# EAGLE schematic esp32_rtc_display_rev2_v9 (EAGLE 9.7.0)

## Sheet 1 of 4
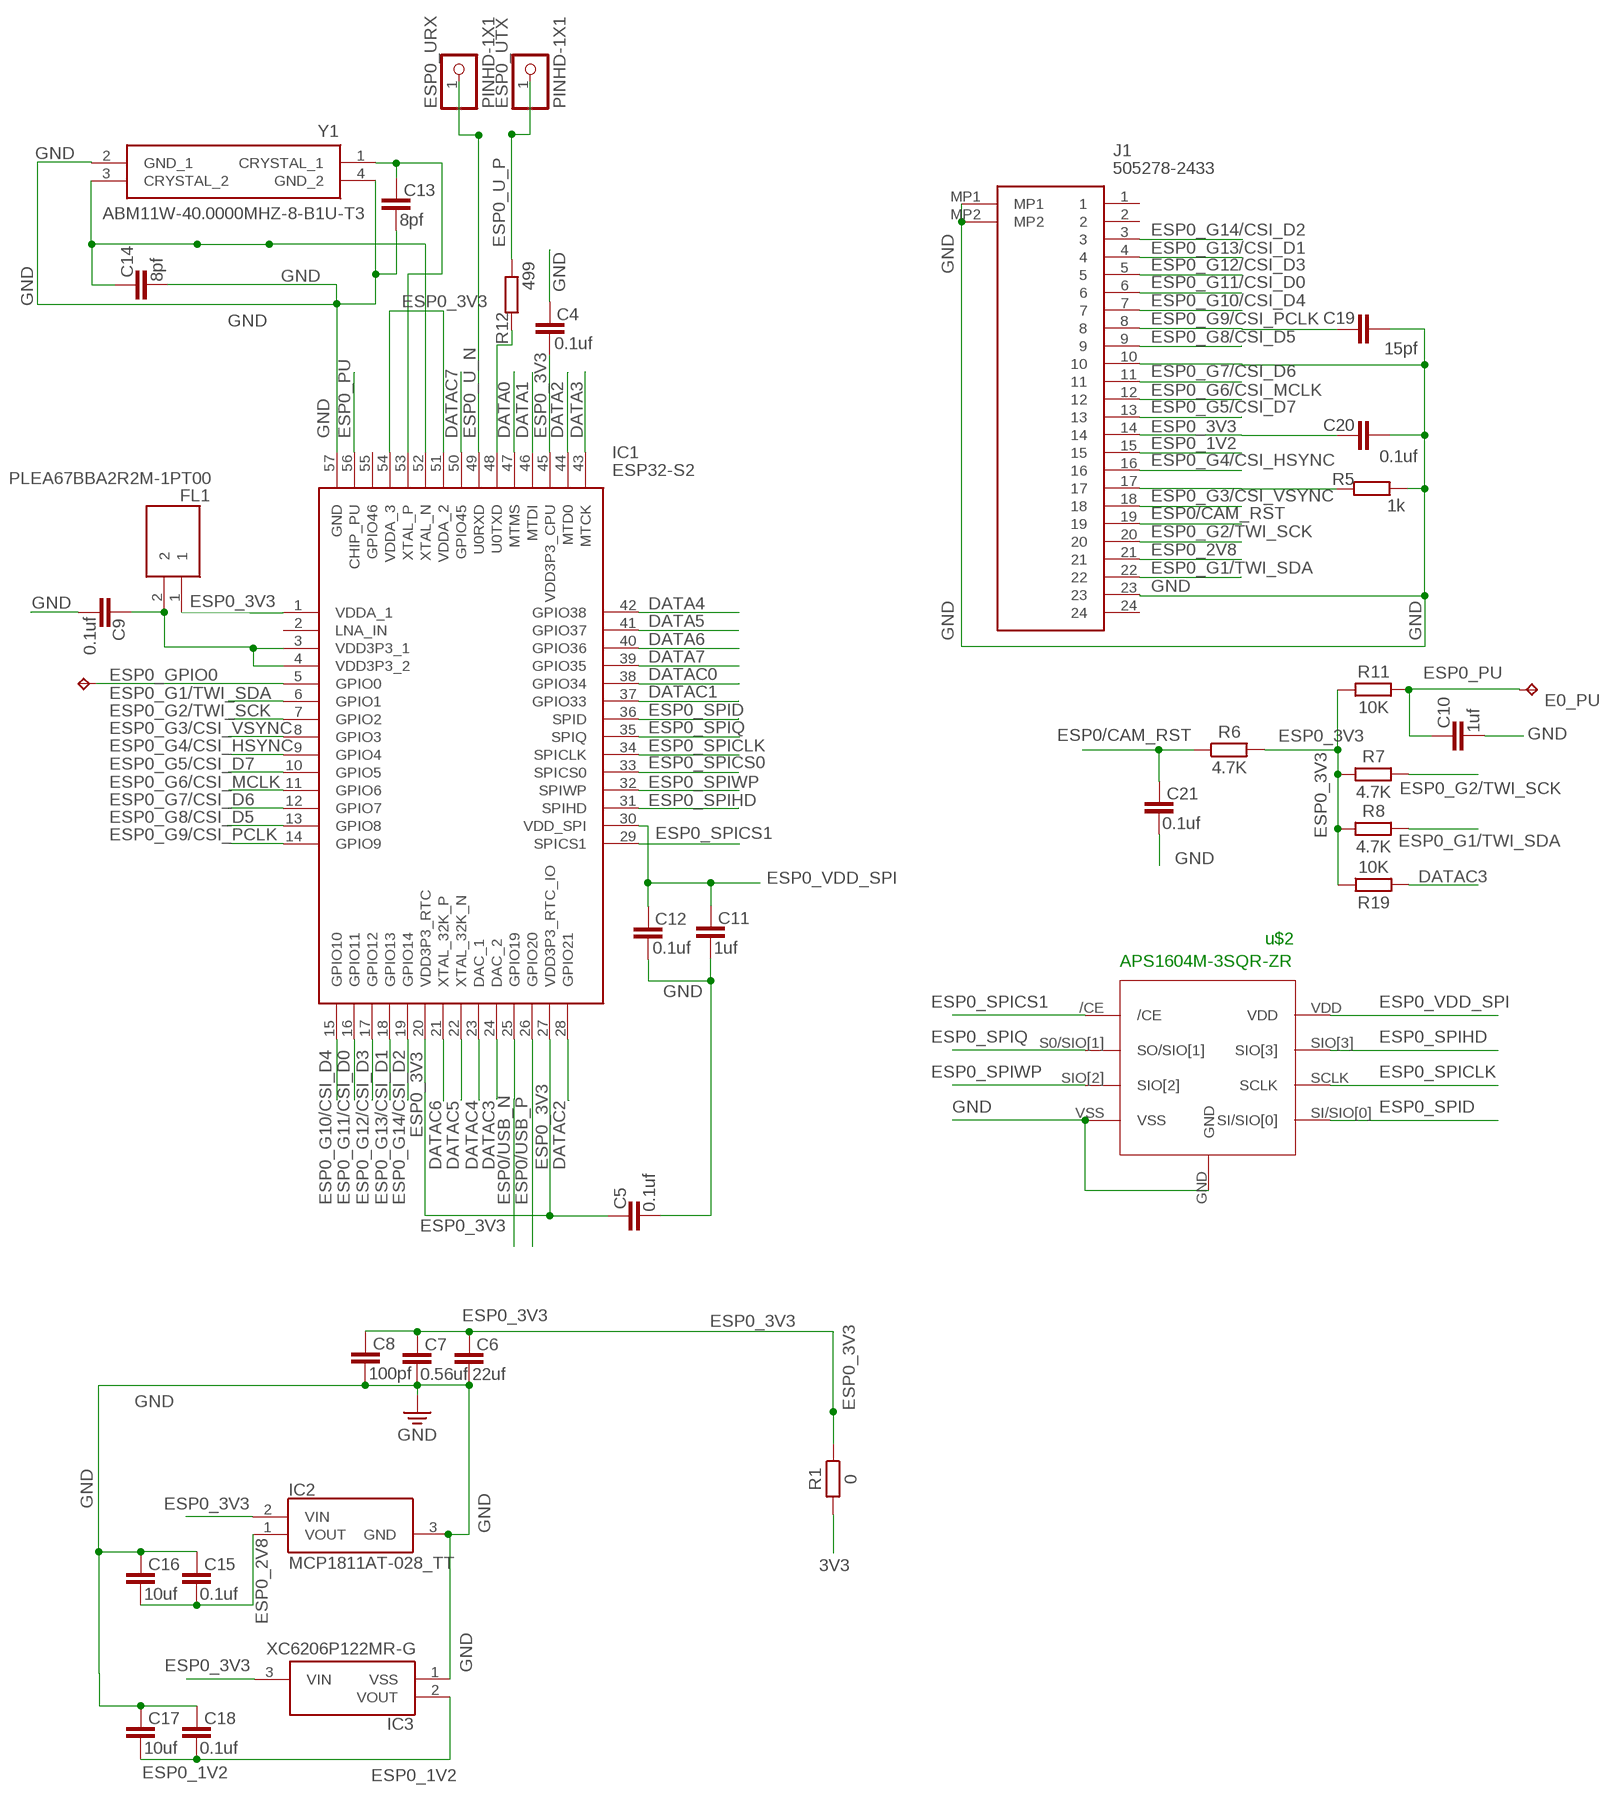
[diagram p0: schematic, sheet 1]

### Parts
C4  0.1uf  C_CHIP-0402(1005-METRIC)  [CAPC1005X60]
C5  0.1uf  C_CHIP-0402(1005-METRIC)  [CAPC1005X60]
C6  22uf  C_CHIP-0402(1005-METRIC)  [CAPC1005X60]
C7  0.56uf  C_CHIP-0402(1005-METRIC)  [CAPC1005X60]
C8  100pf  C_CHIP-0402(1005-METRIC)  [CAPC1005X60]
C9  0.1uf  C_CHIP-0402(1005-METRIC)  [CAPC1005X60]
C10  1uf  C_CHIP-0402(1005-METRIC)  [CAPC1005X60]
C11  1uf  C_CHIP-0402(1005-METRIC)  [CAPC1005X60]
C12  0.1uf  C_CHIP-0402(1005-METRIC)  [CAPC1005X60]
C13  8pf  C_CHIP-0402(1005-METRIC)  [CAPC1005X60]
C14  8pf  C_CHIP-0402(1005-METRIC)  [CAPC1005X60]
C15  0.1uf  C_CHIP-0402(1005-METRIC)  [CAPC1005X60]
C16  10uf  C_CHIP-0402(1005-METRIC)  [CAPC1005X60]
C17  10uf  C_CHIP-0402(1005-METRIC)  [CAPC1005X60]
C18  0.1uf  C_CHIP-0402(1005-METRIC)  [CAPC1005X60]
C19  15pf  C_CHIP-0402(1005-METRIC)  [CAPC1005X60]
C20  0.1uf  C_CHIP-0402(1005-METRIC)  [CAPC1005X60]
C21  0.1uf  C_CHIP-0402(1005-METRIC)  [CAPC1005X60]
E0_G0  TPTP10R  [TP10R]
E0_PU  TPTP10R  [TP10R]
ESP0_URX  PINHD-1X1  [1X01]
ESP0_UTX  PINHD-1X1  [1X01]
FL1  PLEA67BBA2R2M-1PT00  [PLEA67BBA2R2M1PT00]
IC1  ESP32-S2  [QFN40P700X700X90-57N]
IC2  MCP1811AT-028_TT  [SOT65P210X110-3N]
IC3  XC6206P122MR-G  [SOT95P280X130-3N]
J1  505278-2433  [5052782433]
R1  0  R_CHIP-0402(1005-METRIC)  [RESC1005X40]
R5  1k  R_CHIP-0402(1005-METRIC)  [RESC1005X40]
R6  4.7K  R_CHIP-0402(1005-METRIC)  [RESC1005X40]
R7  4.7K  R_CHIP-0402(1005-METRIC)  [RESC1005X40]
R8  4.7K  R_CHIP-0402(1005-METRIC)  [RESC1005X40]
R11  10K  R_CHIP-0402(1005-METRIC)  [RESC1005X40]
R12  499  R_CHIP-0402(1005-METRIC)  [RESC1005X40]
R19  10K  R_CHIP-0402(1005-METRIC)  [RESC1005X40]
U$2  APS1604M-3SQR-ZR  [APS1604M-3SQR-ZR]
Y1  ABM11W-40.0000MHZ-8-B1U-T3  [ABM11W400000MHZ8B1UT3]

### Nets
3V3: R1.2 ; also sheet 2,3,4
DATA0: IC1.47(MTMS) ; also sheet 2,3,4
DATA1: IC1.46(MTDI) ; also sheet 2,3,4
DATA2: IC1.44(MTD0) ; also sheet 2,3,4
DATA3: IC1.43(MTCK) ; also sheet 2,3,4
DATA4: IC1.42(GPIO38) ; also sheet 2,3,4
DATA5: IC1.41(GPIO37) ; also sheet 2,3,4
DATA6: IC1.40(GPIO36) ; also sheet 2,3,4
DATA7: IC1.39(GPIO35) ; also sheet 2,3,4
DATAC0: IC1.38(GPIO34) ; also sheet 2,3,4
DATAC1: IC1.37(GPIO33) ; also sheet 2,3,4
DATAC2: IC1.28(GPIO21) ; also sheet 2,3,4
DATAC3: IC1.24(DAC_2) R19.2 ; also sheet 2,3,4
DATAC4: IC1.23(DAC_1) ; also sheet 2,3,4
DATAC5: IC1.22(XTAL_32K_N) ; also sheet 2,3,4
DATAC6: IC1.21(XTAL_32K_P) ; also sheet 2,3,4
DATAC7: IC1.50(GPIO45) ; also sheet 2,3,4
ESP0/CAM_RST: C21.1 J1.19 R6.1
ESP0/USB_N: IC1.25(GPIO19) ; also sheet 4
ESP0/USB_P: IC1.26(GPIO20) ; also sheet 4
ESP0_1V2: C17.2 C18.2 IC3.2(VOUT) J1.15
ESP0_2V8: C15.2 C16.2 IC2.1(VOUT) J1.21
ESP0_3V3: C4.2 C5.1 C6.1 C7.1 C8.1 C20.1 FL1.1 IC1.1(VDDA_1) IC1.20(VDD3P3_RTC) IC1.27(VDD3P3_RTC_IO) IC1.45(VDD3P3_CPU) IC1.51(VDDA_2) IC1.54(VDDA_3) IC2.2(VIN) IC3.3(VIN) J1.14 R1.1 R6.2 R7.2 R8.2 R11.2 R19.1
ESP0_G1/TWI_SDA: IC1.6(GPIO1) J1.22 R8.1
ESP0_G2/TWI_SCK: IC1.7(GPIO2) J1.20 R7.1
ESP0_G3/CSI_VSYNC: IC1.8(GPIO3) J1.18
ESP0_G4/CSI_HSYNC: IC1.9(GPIO4) J1.16
ESP0_G5/CSI_D7: IC1.10(GPIO5) J1.13
ESP0_G6/CSI_MCLK: IC1.11(GPIO6) J1.12
ESP0_G7/CSI_D6: IC1.12(GPIO7) J1.11
ESP0_G8/CSI_D5: IC1.13(GPIO8) J1.9
ESP0_G9/CSI_PCLK: C19.1 IC1.14(GPIO9) J1.8
ESP0_G10/CSI_D4: IC1.15(GPIO10) J1.7
ESP0_G11/CSI_D0: IC1.16(GPIO11) J1.6
ESP0_G12/CSI_D3: IC1.17(GPIO12) J1.5
ESP0_G13/CSI_D1: IC1.18(GPIO13) J1.4
ESP0_G14/CSI_D2: IC1.19(GPIO14) J1.3
ESP0_GPIO0: E0_G0.TP IC1.5(GPIO0) ; also sheet 4
ESP0_PU: C10.1 E0_PU.TP IC1.56(CHIP_PU) R11.1 ; also sheet 4
ESP0_SPICLK: IC1.34(SPICLK) U$2.SCLK
ESP0_SPICS0: IC1.33(SPICS0)
ESP0_SPICS1: IC1.29(SPICS1) U$2./CE
ESP0_SPID: IC1.36(SPID) U$2.SI/SIO[0]
ESP0_SPIHD: IC1.31(SPIHD) U$2.SIO[3]
ESP0_SPIQ: IC1.35(SPIQ) U$2.S0/SIO[1](SO/SIO[1])
ESP0_SPIWP: IC1.32(SPIWP) U$2.SIO[2]
ESP0_U_N: ESP0_URX.1 IC1.49(U0RXD) ; also sheet 4
ESP0_U_P: ESP0_UTX.1 R12.2 ; also sheet 4
ESP0_VDD_SPI: C11.1 C12.1 IC1.30(VDD_SPI) U$2.VDD
GND: C4.1 C5.2 C6.2 C7.2 C8.2 C9.2 C10.2 C11.2 C12.2 C13.2 C14.2 C15.1 C16.1 C17.1 C18.1 C19.2 C20.2 C21.2 IC1.57(GND) IC2.3(GND) IC3.1(VSS) J1.10 J1.23 J1.MP1 J1.MP2 R5.2 U$2.GND U$2.VSS Y1.2(GND_1) Y1.4(GND_2) ; also sheet 2,3,4
N$4: C13.1 IC1.53(XTAL_P) Y1.1(CRYSTAL_1)
N$6: IC1.48(U0TXD) R12.1
N$7: C14.1 IC1.52(XTAL_N) Y1.3(CRYSTAL_2)
N$22: J1.17 R5.1
N$38: C9.1 FL1.2 IC1.3(VDD3P3_1) IC1.4(VDD3P3_2)
Unconnected: IC1.2(LNA_IN) IC1.55(GPIO46) J1.1 J1.2 J1.24

### Notes on the sheet
- u$2
- APS1604M-3SQR-ZR

## Sheet 2 of 4
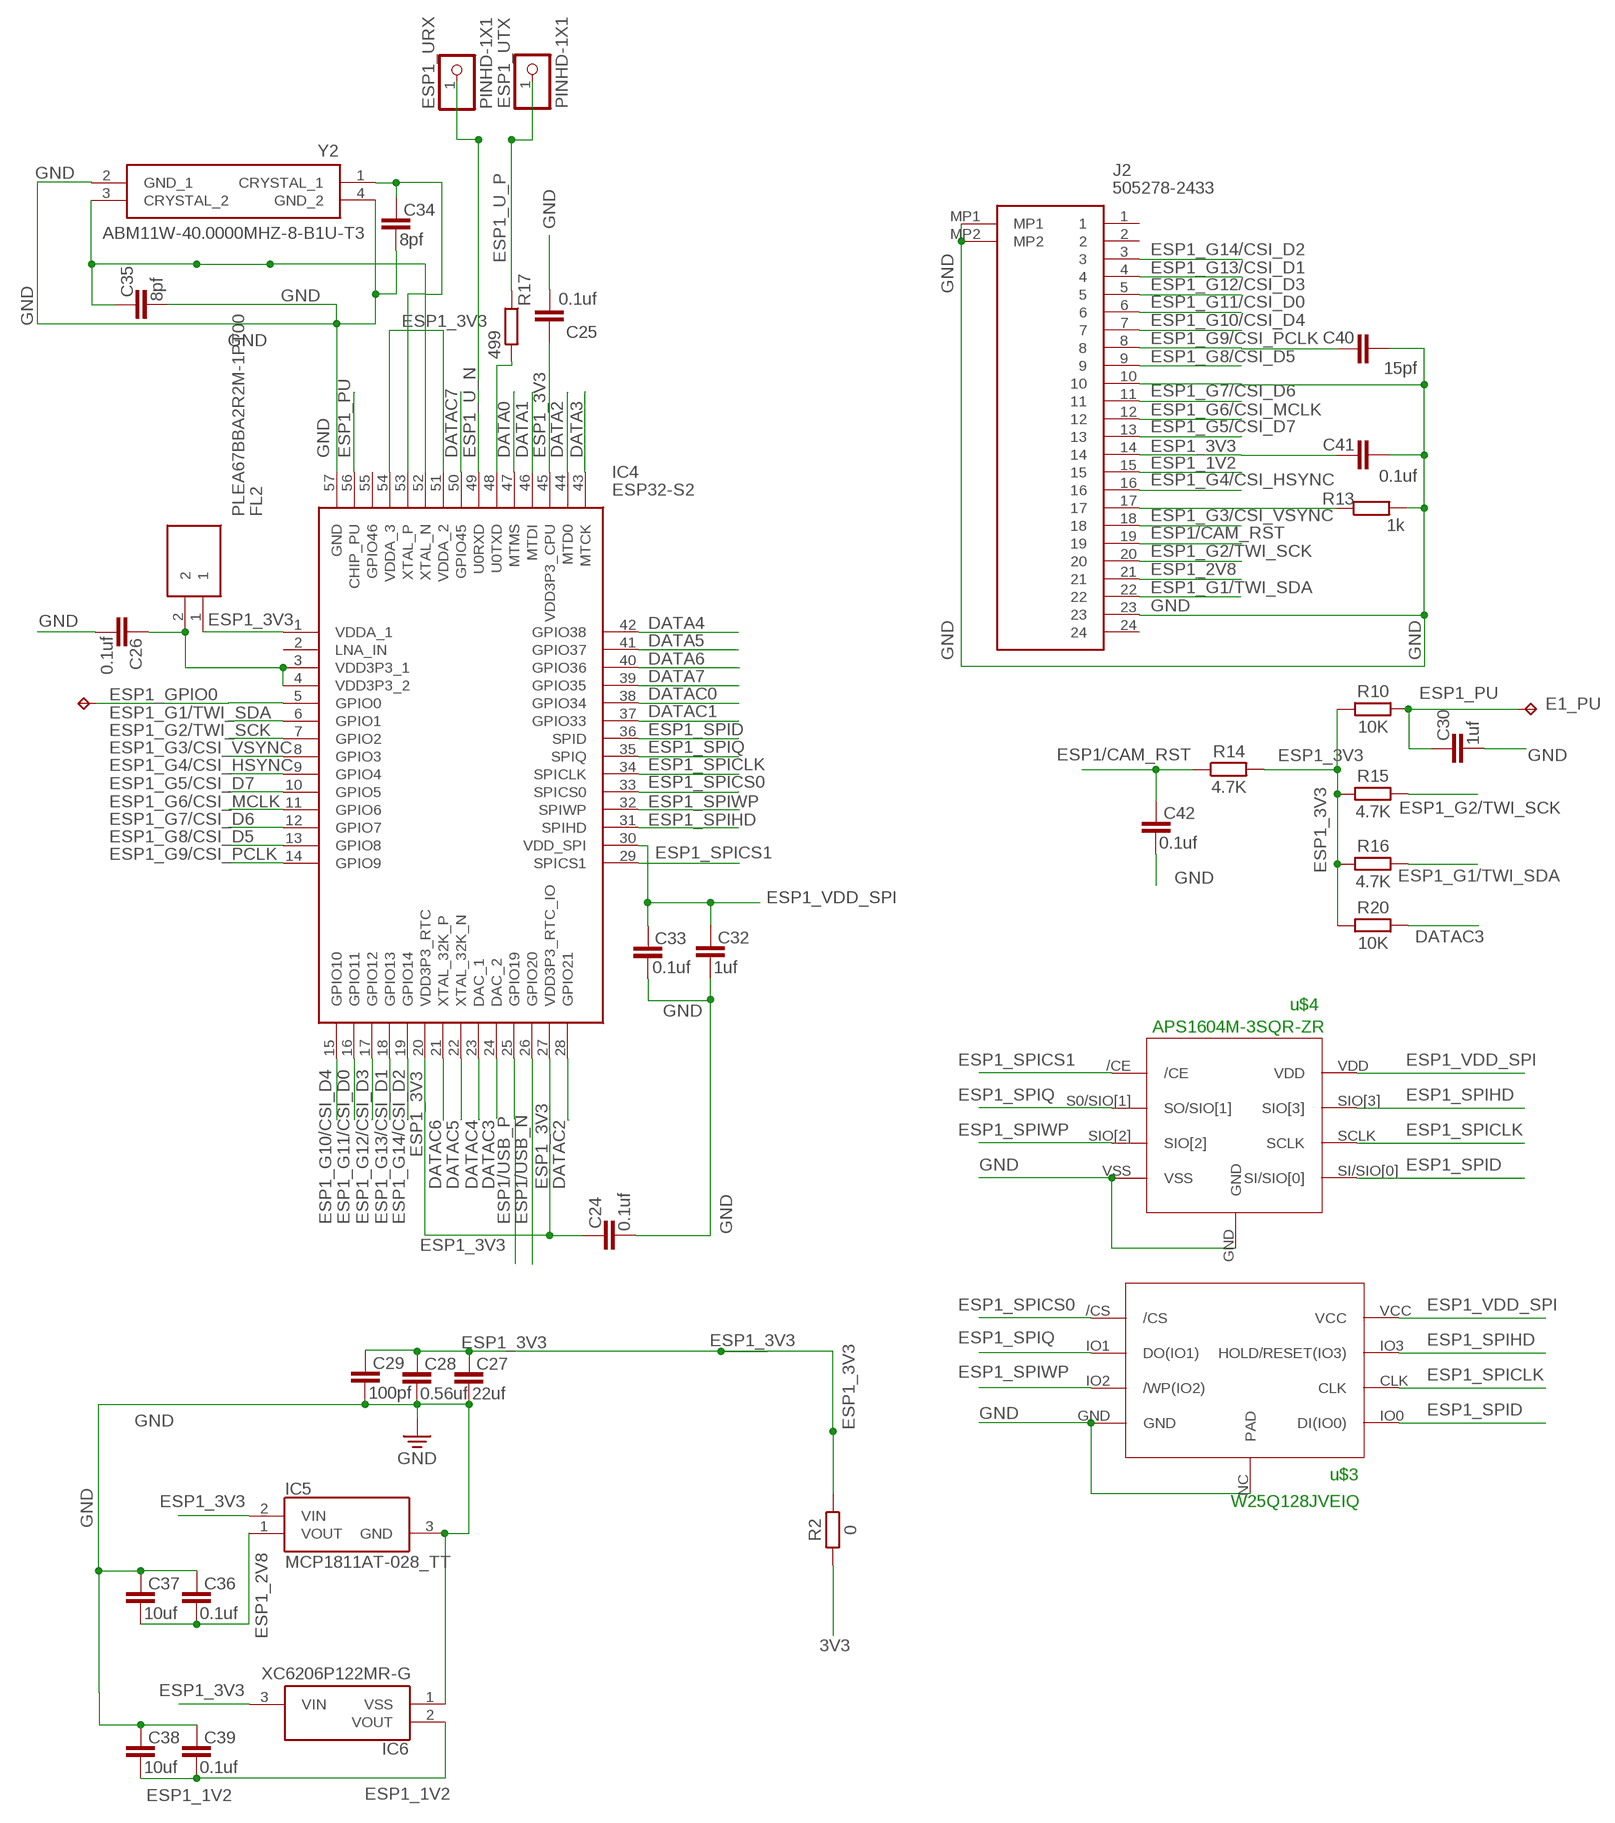
[diagram p1: schematic, sheet 2]

### Parts
C24  0.1uf  C_CHIP-0402(1005-METRIC)  [CAPC1005X60]
C25  0.1uf  C_CHIP-0402(1005-METRIC)  [CAPC1005X60]
C26  0.1uf  C_CHIP-0402(1005-METRIC)  [CAPC1005X60]
C27  22uf  C_CHIP-0402(1005-METRIC)  [CAPC1005X60]
C28  0.56uf  C_CHIP-0402(1005-METRIC)  [CAPC1005X60]
C29  100pf  C_CHIP-0402(1005-METRIC)  [CAPC1005X60]
C30  1uf  C_CHIP-0402(1005-METRIC)  [CAPC1005X60]
C32  1uf  C_CHIP-0402(1005-METRIC)  [CAPC1005X60]
C33  0.1uf  C_CHIP-0402(1005-METRIC)  [CAPC1005X60]
C34  8pf  C_CHIP-0402(1005-METRIC)  [CAPC1005X60]
C35  8pf  C_CHIP-0402(1005-METRIC)  [CAPC1005X60]
C36  0.1uf  C_CHIP-0402(1005-METRIC)  [CAPC1005X60]
C37  10uf  C_CHIP-0402(1005-METRIC)  [CAPC1005X60]
C38  10uf  C_CHIP-0402(1005-METRIC)  [CAPC1005X60]
C39  0.1uf  C_CHIP-0402(1005-METRIC)  [CAPC1005X60]
C40  15pf  C_CHIP-0402(1005-METRIC)  [CAPC1005X60]
C41  0.1uf  C_CHIP-0402(1005-METRIC)  [CAPC1005X60]
C42  0.1uf  C_CHIP-0402(1005-METRIC)  [CAPC1005X60]
E1_G0  TPTP10R  [TP10R]
E1_PU  TPTP10R  [TP10R]
ESP1_URX  PINHD-1X1  [1X01]
ESP1_UTX  PINHD-1X1  [1X01]
FL2  PLEA67BBA2R2M-1PT00  [PLEA67BBA2R2M1PT00]
IC4  ESP32-S2  [QFN40P700X700X90-57N]
IC5  MCP1811AT-028_TT  [SOT65P210X110-3N]
IC6  XC6206P122MR-G  [SOT95P280X130-3N]
J2  505278-2433  [5052782433]
R2  0  R_CHIP-0402(1005-METRIC)  [RESC1005X40]
R10  10K  R_CHIP-0402(1005-METRIC)  [RESC1005X40]
R13  1k  R_CHIP-0402(1005-METRIC)  [RESC1005X40]
R14  4.7K  R_CHIP-0402(1005-METRIC)  [RESC1005X40]
R15  4.7K  R_CHIP-0402(1005-METRIC)  [RESC1005X40]
R16  4.7K  R_CHIP-0402(1005-METRIC)  [RESC1005X40]
R17  499  R_CHIP-0402(1005-METRIC)  [RESC1005X40]
R20  10K  R_CHIP-0402(1005-METRIC)  [RESC1005X40]
U$3  W25Q128JVEIQ  [W25Q128JVEIQ]
U$4  APS1604M-3SQR-ZR  [APS1604M-3SQR-ZR]
Y2  ABM11W-40.0000MHZ-8-B1U-T3  [ABM11W400000MHZ8B1UT3]

### Nets
3V3: R2.2 ; also sheet 1,3,4
DATA0: IC4.47(MTMS) ; also sheet 1,3,4
DATA1: IC4.46(MTDI) ; also sheet 1,3,4
DATA2: IC4.44(MTD0) ; also sheet 1,3,4
DATA3: IC4.43(MTCK) ; also sheet 1,3,4
DATA4: IC4.42(GPIO38) ; also sheet 1,3,4
DATA5: IC4.41(GPIO37) ; also sheet 1,3,4
DATA6: IC4.40(GPIO36) ; also sheet 1,3,4
DATA7: IC4.39(GPIO35) ; also sheet 1,3,4
DATAC0: IC4.38(GPIO34) ; also sheet 1,3,4
DATAC1: IC4.37(GPIO33) ; also sheet 1,3,4
DATAC2: IC4.28(GPIO21) ; also sheet 1,3,4
DATAC3: IC4.24(DAC_2) R20.1 ; also sheet 1,3,4
DATAC4: IC4.23(DAC_1) ; also sheet 1,3,4
DATAC5: IC4.22(XTAL_32K_N) ; also sheet 1,3,4
DATAC6: IC4.21(XTAL_32K_P) ; also sheet 1,3,4
DATAC7: IC4.50(GPIO45) ; also sheet 1,3,4
ESP1/CAM_RST: C42.1 J2.19 R14.1
ESP1/USB_N: IC4.26(GPIO20) ; also sheet 4
ESP1/USB_P: IC4.25(GPIO19) ; also sheet 4
ESP1_1V2: C38.2 C39.2 IC6.2(VOUT) J2.15
ESP1_2V8: C36.2 C37.2 IC5.1(VOUT) J2.21
ESP1_3V3: C24.1 C25.1 C27.1 C28.1 C29.1 C41.1 FL2.1 IC4.1(VDDA_1) IC4.20(VDD3P3_RTC) IC4.27(VDD3P3_RTC_IO) IC4.45(VDD3P3_CPU) IC4.51(VDDA_2) IC4.54(VDDA_3) IC5.2(VIN) IC6.3(VIN) J2.14 R2.1 R10.2 R14.2 R15.2 R16.2 R20.2
ESP1_G1/TWI_SDA: IC4.6(GPIO1) J2.22 R16.1
ESP1_G2/TWI_SCK: IC4.7(GPIO2) J2.20 R15.1
ESP1_G3/CSI_VSYNC: IC4.8(GPIO3) J2.18
ESP1_G4/CSI_HSYNC: IC4.9(GPIO4) J2.16
ESP1_G5/CSI_D7: IC4.10(GPIO5) J2.13
ESP1_G6/CSI_MCLK: IC4.11(GPIO6) J2.12
ESP1_G7/CSI_D6: IC4.12(GPIO7) J2.11
ESP1_G8/CSI_D5: IC4.13(GPIO8) J2.9
ESP1_G9/CSI_PCLK: C40.1 IC4.14(GPIO9) J2.8
ESP1_G10/CSI_D4: IC4.15(GPIO10) J2.7
ESP1_G11/CSI_D0: IC4.16(GPIO11) J2.6
ESP1_G12/CSI_D3: IC4.17(GPIO12) J2.5
ESP1_G13/CSI_D1: IC4.18(GPIO13) J2.4
ESP1_G14/CSI_D2: IC4.19(GPIO14) J2.3
ESP1_GPIO0: E1_G0.TP IC4.5(GPIO0) ; also sheet 4
ESP1_PU: C30.1 E1_PU.TP IC4.56(CHIP_PU) R10.1 ; also sheet 4
ESP1_SPICLK: IC4.34(SPICLK) U$3.CLK U$4.SCLK
ESP1_SPICS0: IC4.33(SPICS0) U$3./CS
ESP1_SPICS1: IC4.29(SPICS1) U$4./CE
ESP1_SPID: IC4.36(SPID) U$3.IO0(DI(IO0)) U$4.SI/SIO[0]
ESP1_SPIHD: IC4.31(SPIHD) U$3.IO3(HOLD/RESET(IO3)) U$4.SIO[3]
ESP1_SPIQ: IC4.35(SPIQ) U$3.IO1(DO(IO1)) U$4.S0/SIO[1](SO/SIO[1])
ESP1_SPIWP: IC4.32(SPIWP) U$3.IO2(/WP(IO2)) U$4.SIO[2]
ESP1_U_N: ESP1_URX.1 IC4.49(U0RXD) ; also sheet 4
ESP1_U_P: ESP1_UTX.1 R17.1 ; also sheet 4
ESP1_VDD_SPI: C32.1 C33.1 IC4.30(VDD_SPI) U$3.VCC U$4.VDD
GND: C24.2 C25.2 C26.2 C27.2 C28.2 C29.2 C30.2 C32.2 C33.2 C34.2 C35.2 C36.1 C37.1 C38.1 C39.1 C40.2 C41.2 C42.2 IC4.57(GND) IC5.3(GND) IC6.1(VSS) J2.10 J2.23 J2.MP1 J2.MP2 R13.2 U$3.GND U$3.NC(PAD) U$4.GND U$4.VSS Y2.2(GND_1) Y2.4(GND_2) ; also sheet 1,3,4
N$5: IC4.48(U0TXD) R17.2
N$12: C35.1 IC4.52(XTAL_N) Y2.3(CRYSTAL_2)
N$13: C34.1 IC4.53(XTAL_P) Y2.1(CRYSTAL_1)
N$14: J2.17 R13.1
N$44: C26.1 FL2.2 IC4.3(VDD3P3_1) IC4.4(VDD3P3_2)
Unconnected: IC4.2(LNA_IN) IC4.55(GPIO46) J2.1 J2.2 J2.24

### Notes on the sheet
- u$4
- APS1604M-3SQR-ZR
- u$3
- W25Q128JVEIQ

## Sheet 3 of 4
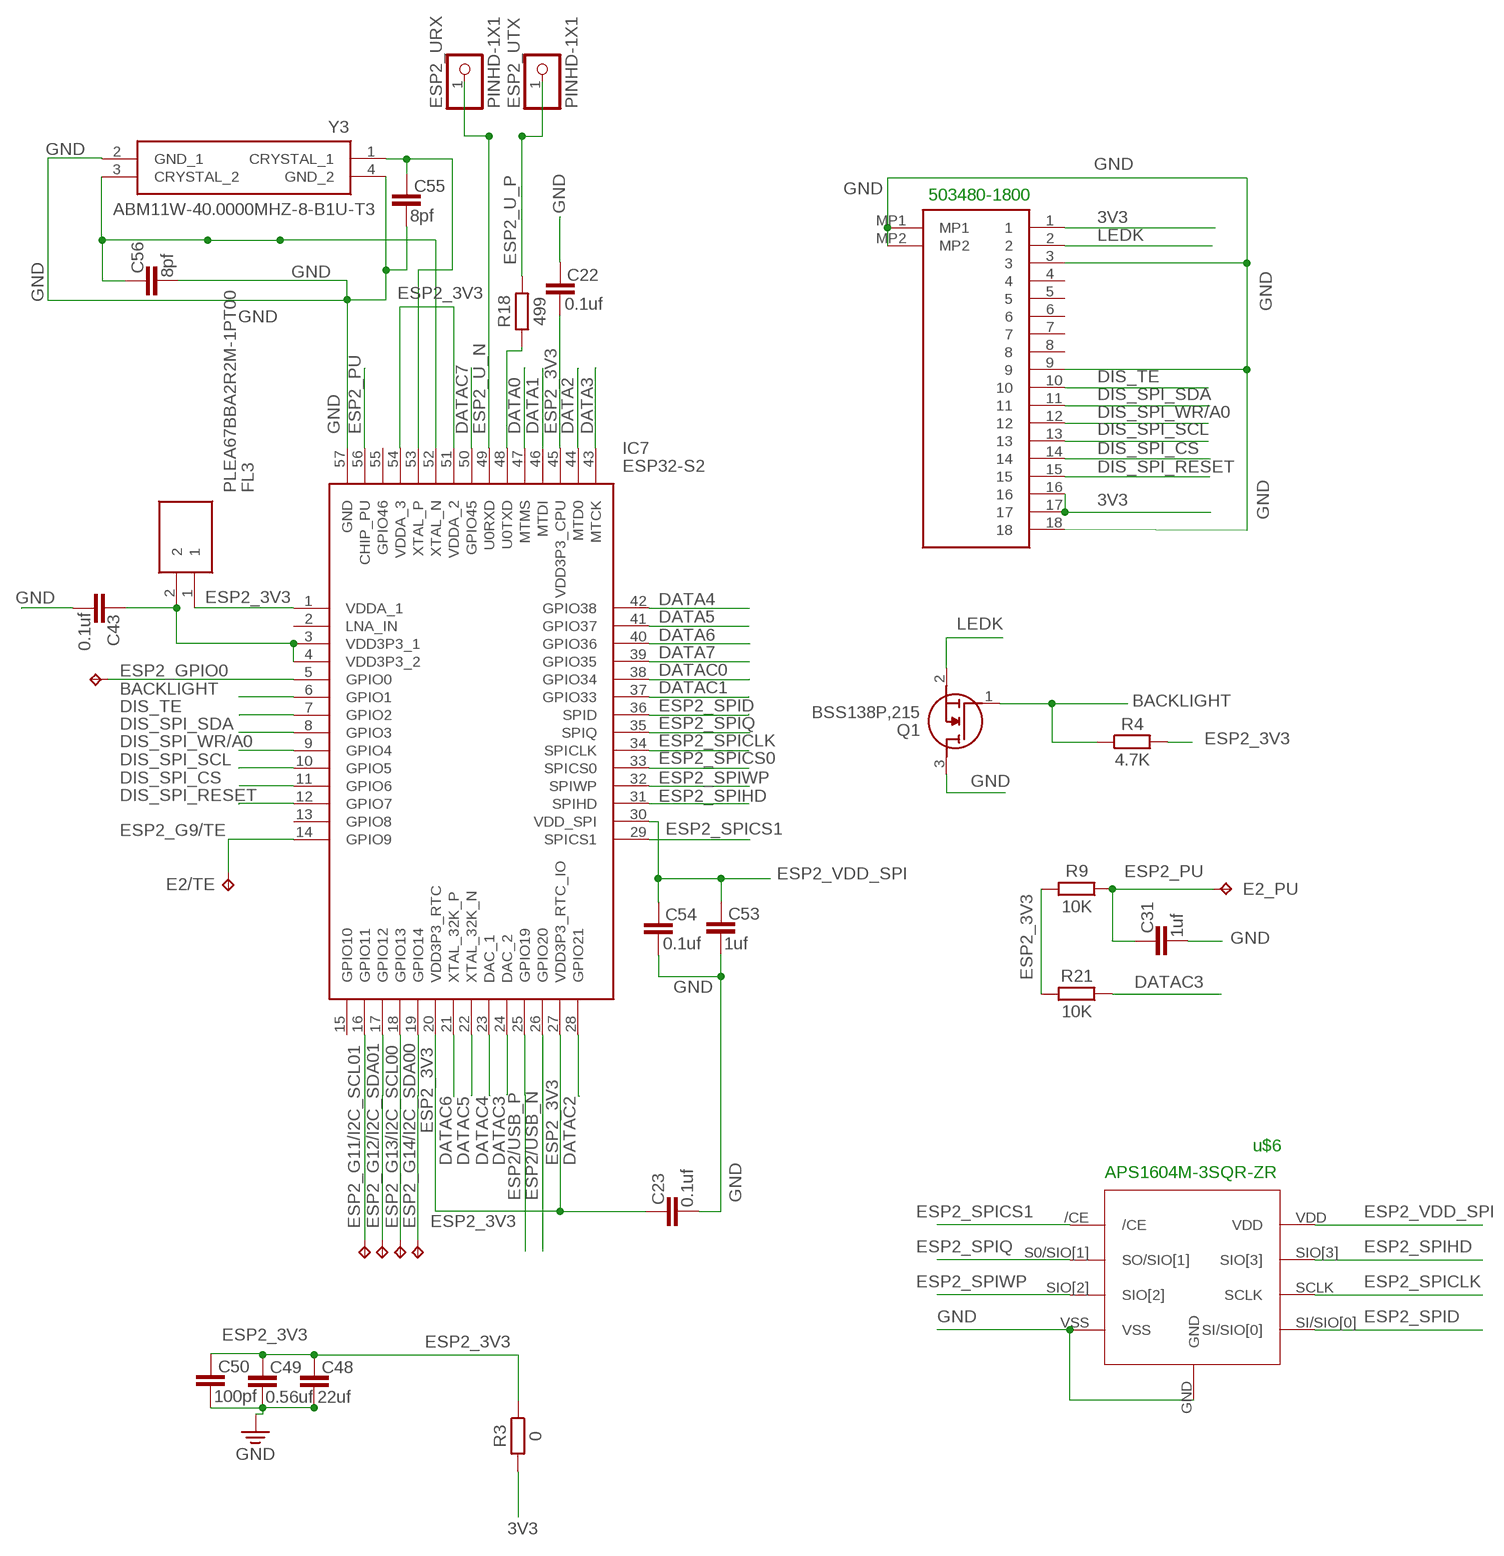
[diagram p2: schematic, sheet 3]

### Parts
C22  0.1uf  C_CHIP-0402(1005-METRIC)  [CAPC1005X60]
C23  0.1uf  C_CHIP-0402(1005-METRIC)  [CAPC1005X60]
C31  1uf  C_CHIP-0402(1005-METRIC)  [CAPC1005X60]
C43  0.1uf  C_CHIP-0402(1005-METRIC)  [CAPC1005X60]
C48  22uf  C_CHIP-0402(1005-METRIC)  [CAPC1005X60]
C49  0.56uf  C_CHIP-0402(1005-METRIC)  [CAPC1005X60]
C50  100pf  C_CHIP-0402(1005-METRIC)  [CAPC1005X60]
C53  1uf  C_CHIP-0402(1005-METRIC)  [CAPC1005X60]
C54  0.1uf  C_CHIP-0402(1005-METRIC)  [CAPC1005X60]
C55  8pf  C_CHIP-0402(1005-METRIC)  [CAPC1005X60]
C56  8pf  C_CHIP-0402(1005-METRIC)  [CAPC1005X60]
E2/TE  TPTP10R  [TP10R]
E2_G0  TPTP10R  [TP10R]
E2_PU  TPTP10R  [TP10R]
ESP2_URX  PINHD-1X1  [1X01]
ESP2_UTX  PINHD-1X1  [1X01]
FL3  PLEA67BBA2R2M-1PT00  [PLEA67BBA2R2M1PT00]
IC7  ESP32-S2  [QFN40P700X700X90-57N]
Q1  BSS138P,215  [SOT95P230X110-3N]
R3  0  R_CHIP-0402(1005-METRIC)  [RESC1005X40]
R4  4.7K  R_CHIP-0402(1005-METRIC)  [RESC1005X40]
R9  10K  R_CHIP-0402(1005-METRIC)  [RESC1005X40]
R18  499  R_CHIP-0402(1005-METRIC)  [RESC1005X40]
R21  10K  R_CHIP-0402(1005-METRIC)  [RESC1005X40]
SCL00  TPTP10R  [TP10R]
SCL01  TPTP10R  [TP10R]
SDA00  TPTP10R  [TP10R]
SDA01  TPTP10R  [TP10R]
U$5  503480-1800  [5034801800]
U$6  APS1604M-3SQR-ZR  [APS1604M-3SQR-ZR]
Y3  ABM11W-40.0000MHZ-8-B1U-T3  [ABM11W400000MHZ8B1UT3]

### Nets
3V3: R3.2 U$5.1 U$5.16 U$5.17 ; also sheet 1,2,4
BACKLIGHT: IC7.6(GPIO1) Q1.1(G) R4.1
DATA0: IC7.47(MTMS) ; also sheet 1,2,4
DATA1: IC7.46(MTDI) ; also sheet 1,2,4
DATA2: IC7.44(MTD0) ; also sheet 1,2,4
DATA3: IC7.43(MTCK) ; also sheet 1,2,4
DATA4: IC7.42(GPIO38) ; also sheet 1,2,4
DATA5: IC7.41(GPIO37) ; also sheet 1,2,4
DATA6: IC7.40(GPIO36) ; also sheet 1,2,4
DATA7: IC7.39(GPIO35) ; also sheet 1,2,4
DATAC0: IC7.38(GPIO34) ; also sheet 1,2,4
DATAC1: IC7.37(GPIO33) ; also sheet 1,2,4
DATAC2: IC7.28(GPIO21) ; also sheet 1,2,4
DATAC3: IC7.24(DAC_2) R21.1 ; also sheet 1,2,4
DATAC4: IC7.23(DAC_1) ; also sheet 1,2,4
DATAC5: IC7.22(XTAL_32K_N) ; also sheet 1,2,4
DATAC6: IC7.21(XTAL_32K_P) ; also sheet 1,2,4
DATAC7: IC7.50(GPIO45) ; also sheet 1,2,4
DIS_SPI_CS: IC7.11(GPIO6) U$5.14
DIS_SPI_RESET: IC7.12(GPIO7) U$5.15
DIS_SPI_SCL: IC7.10(GPIO5) U$5.13
DIS_SPI_SDA: IC7.8(GPIO3) U$5.11
DIS_SPI_WR/A0: IC7.9(GPIO4) U$5.12
DIS_TE: IC7.7(GPIO2) U$5.10
ESP2/USB_N: IC7.26(GPIO20) ; also sheet 4
ESP2/USB_P: IC7.25(GPIO19) ; also sheet 4
ESP2_3V3: C22.2 C23.1 C48.1 C49.1 C50.1 FL3.1 IC7.1(VDDA_1) IC7.20(VDD3P3_RTC) IC7.27(VDD3P3_RTC_IO) IC7.45(VDD3P3_CPU) IC7.51(VDDA_2) IC7.54(VDDA_3) R3.1 R4.2 R9.2 R21.2
ESP2_G9/TE: E2/TE.TP IC7.14(GPIO9)
ESP2_G11/I2C_SCL01: IC7.16(GPIO11) SCL01.TP
ESP2_G12/I2C_SDA01: IC7.17(GPIO12) SDA01.TP
ESP2_G13/I2C_SCL00: IC7.18(GPIO13) SCL00.TP
ESP2_G14/I2C_SDA00: IC7.19(GPIO14) SDA00.TP
ESP2_GPIO0: E2_G0.TP IC7.5(GPIO0) ; also sheet 4
ESP2_PU: C31.1 E2_PU.TP IC7.56(CHIP_PU) R9.1 ; also sheet 4
ESP2_SPICLK: IC7.34(SPICLK) U$6.SCLK
ESP2_SPICS0: IC7.33(SPICS0)
ESP2_SPICS1: IC7.29(SPICS1) U$6./CE
ESP2_SPID: IC7.36(SPID) U$6.SI/SIO[0]
ESP2_SPIHD: IC7.31(SPIHD) U$6.SIO[3]
ESP2_SPIQ: IC7.35(SPIQ) U$6.S0/SIO[1](SO/SIO[1])
ESP2_SPIWP: IC7.32(SPIWP) U$6.SIO[2]
ESP2_U_N: ESP2_URX.1 IC7.49(U0RXD) ; also sheet 4
ESP2_U_P: ESP2_UTX.1 R18.2 ; also sheet 4
ESP2_VDD_SPI: C53.1 C54.1 IC7.30(VDD_SPI) U$6.VDD
GND: C22.1 C23.2 C31.2 C43.2 C48.2 C49.2 C50.2 C53.2 C54.2 C55.2 C56.2 IC7.57(GND) Q1.3(D) U$5.3 U$5.9 U$5.18 U$5.MP1 U$5.MP2 U$6.GND U$6.VSS Y3.2(GND_1) Y3.4(GND_2) ; also sheet 1,2,4
LEDK: Q1.2(S) U$5.2
N$20: C56.1 IC7.52(XTAL_N) Y3.3(CRYSTAL_2)
N$21: C55.1 IC7.53(XTAL_P) Y3.1(CRYSTAL_1)
N$29: IC7.48(U0TXD) R18.1
N$43: C43.1 FL3.2 IC7.3(VDD3P3_1) IC7.4(VDD3P3_2)
Unconnected: IC7.2(LNA_IN) IC7.13(GPIO8) IC7.15(GPIO10) IC7.55(GPIO46) U$5.4 U$5.5 U$5.6 U$5.7 U$5.8

### Notes on the sheet
- 503480-1800
- u$6
- APS1604M-3SQR-ZR

## Sheet 4 of 4
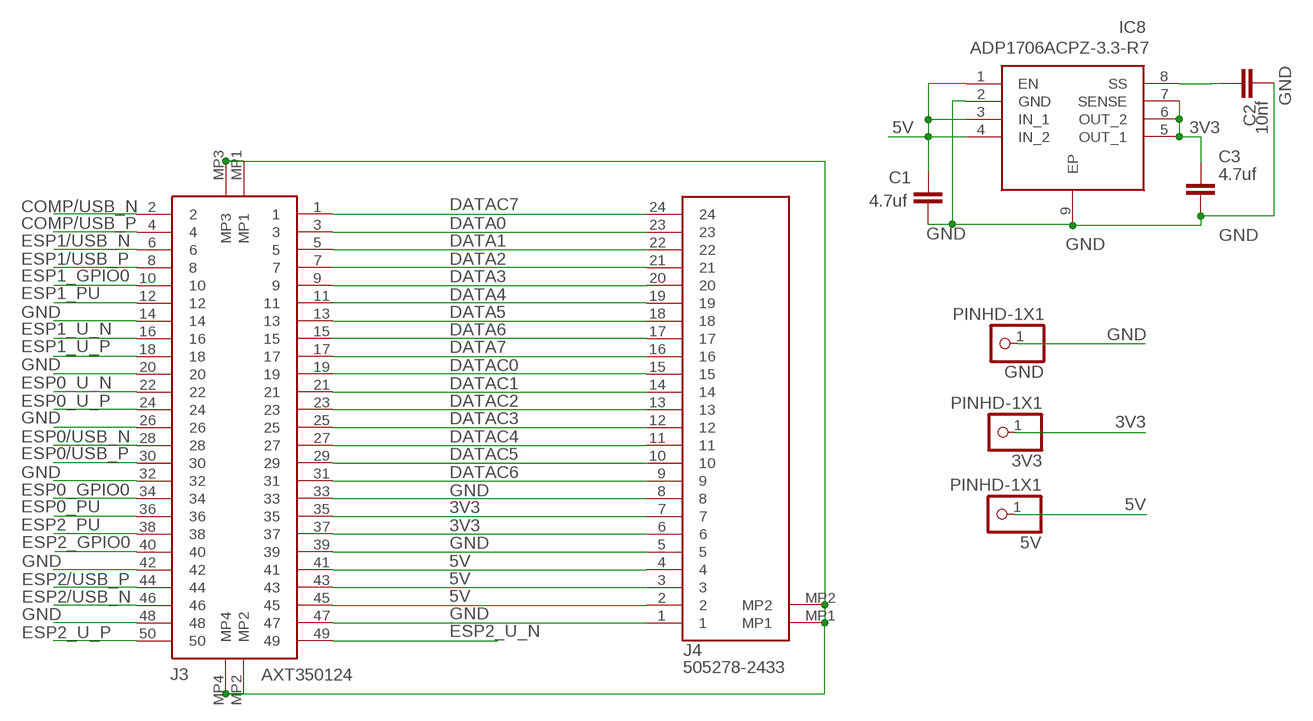
[diagram p3: schematic, sheet 4]

### Parts
3V3  PINHD-1X1  [1X01]
5V  PINHD-1X1  [1X01]
C1  4.7uf  C_CHIP-0402(1005-METRIC)  [CAPC1005X60]
C2  10nf  C_CHIP-0402(1005-METRIC)  [CAPC1005X60]
C3  4.7uf  C_CHIP-0402(1005-METRIC)  [CAPC1005X60]
GND  PINHD-1X1  [1X01]
IC8  ADP1706ACPZ-3.3-R7  [SON50P300X300X80-9N]
J3  AXT350124  [AXT350124]
J4  505278-2433  [5052782433]

### Nets
3V3: 3V3.1 C3.1 IC8.5(OUT_1) IC8.6(OUT_2) IC8.7(SENSE) J3.35 J3.37 J4.6 J4.7 ; also sheet 1,2,3
5V: 5V.1 C1.1 IC8.1(EN) IC8.3(IN_1) IC8.4(IN_2) J3.41 J3.43 J3.45 J4.2 J4.3 J4.4
COMP/USB_N: J3.2
COMP/USB_P: J3.4
DATA0: J3.3 J4.23 ; also sheet 1,2,3
DATA1: J3.5 J4.22 ; also sheet 1,2,3
DATA2: J3.7 J4.21 ; also sheet 1,2,3
DATA3: J3.9 J4.20 ; also sheet 1,2,3
DATA4: J3.11 J4.19 ; also sheet 1,2,3
DATA5: J3.13 J4.18 ; also sheet 1,2,3
DATA6: J3.15 J4.17 ; also sheet 1,2,3
DATA7: J3.17 J4.16 ; also sheet 1,2,3
DATAC0: J3.19 J4.15 ; also sheet 1,2,3
DATAC1: J3.21 J4.14 ; also sheet 1,2,3
DATAC2: J3.23 J4.13 ; also sheet 1,2,3
DATAC3: J3.25 J4.12 ; also sheet 1,2,3
DATAC4: J3.27 J4.11 ; also sheet 1,2,3
DATAC5: J3.29 J4.10 ; also sheet 1,2,3
DATAC6: J3.31 J4.9 ; also sheet 1,2,3
DATAC7: J3.1 J4.24 ; also sheet 1,2,3
ESP0/USB_N: J3.28 ; also sheet 1
ESP0/USB_P: J3.30 ; also sheet 1
ESP0_GPIO0: J3.34 ; also sheet 1
ESP0_PU: J3.36 ; also sheet 1
ESP0_U_N: J3.22 ; also sheet 1
ESP0_U_P: J3.24 ; also sheet 1
ESP1/USB_N: J3.6 ; also sheet 2
ESP1/USB_P: J3.8 ; also sheet 2
ESP1_GPIO0: J3.10 ; also sheet 2
ESP1_PU: J3.12 ; also sheet 2
ESP1_U_N: J3.16 ; also sheet 2
ESP1_U_P: J3.18 ; also sheet 2
ESP2/USB_N: J3.46 ; also sheet 3
ESP2/USB_P: J3.44 ; also sheet 3
ESP2_GPIO0: J3.40 ; also sheet 3
ESP2_PU: J3.38 ; also sheet 3
ESP2_U_N: J3.49 ; also sheet 3
ESP2_U_P: J3.50 ; also sheet 3
GND: C1.2 C2.1 C3.2 GND.1 IC8.2(GND) IC8.9(EP) J3.14 J3.20 J3.26 J3.32 J3.33 J3.39 J3.42 J3.47 J3.48 J3.MP1 J3.MP2 J3.MP3 J3.MP4 J4.1 J4.5 J4.8 J4.MP1 J4.MP2 ; also sheet 1,2,3
N$3: C2.2 IC8.8(SS)

## Library data of the parts
3V3 5V ESP0_URX ESP0_UTX ESP1_URX ESP1_UTX ESP2_URX ESP2_UTX GND = Connector:PINHD-1X1: PIN HEADER; CATEGORY: CONNECTOR; SUB-CATEGORY: PIN-HEADER
C1-C43 C48-C50 C53-C56 = Capacitor:C: Capacitor - Generic; CATEGORY: Capacitor
E0_G0 E0_PU E1_G0 E1_PU E2/TE E2_G0 E2_PU SCL00 SCL01 SDA00 SDA01 = testpad:TP: Test pad
FL1-FL3 = PLEA67BBA2R2M-1PT00:PLEA67BBA2R2M-1PT00: Fixed Inductors 2.2uH 20% 620mOhm 0.5A/002 Source: Datasheet <https://product.tdk.com/system/files/dam/doc/product/inductor/inductor/smd/catalog/inductor_commercial_power_plea67bba_en.pdf>; DESCRIPTION: Fixed Inductors 2.2uH 20% 620mOhm 0.5A/002; HEIGHT: 0.8mm; MANUFACTURER_NAME: TDK; MANUFACTURER_PART_NUMBER: PLEA67BBA2R2M-1PT00; MOUSER_PART_NUMBER: 810-PLEA67BBA2R2M1PT; MOUSER_PRICE-STOCK: https://www.mouser.co.uk/ProductDetail/TDK/PLEA67BBA2R2M-1PT00?qs=CiayqK2gdcIbgqVnhPM2%252BA%3D%3D
IC1 IC4 IC7 = ESP32-S2:ESP32-S2: SMD WI-FI IC, ESP32-S2, SINGAL-C Source: Datasheet <https://componentsearchengine.com/Datasheets/1/ESP32-S2.pdf>; DESCRIPTION: SMD WI-FI IC, ESP32-S2, SINGAL-C; HEIGHT: 0.9mm; MANUFACTURER_NAME: Espressif Systems; MANUFACTURER_PART_NUMBER: ESP32-S2; MOUSER_PART_NUMBER: 356-ESP32-S2; MOUSER_PRICE-STOCK: https://www.mouser.co.uk/ProductDetail/Espressif-Systems/ESP32-S2?qs=GBLSl2Akirtmlui%2FgtDaSQ%3D%3D
IC2 IC5 = MCP1811AT-028_TT:MCP1811AT-028_TT: LDO Regulator Pos 2.8V 0.15A 3-Pin SOT-23 T/R Source: Datasheet; DESCRIPTION: LDO Regulator Pos 2.8V 0.15A 3-Pin SOT-23 T/R; HEIGHT: 1.1mm; MANUFACTURER_NAME: Microchip; MANUFACTURER_PART_NUMBER: MCP1811AT-028/TT; MOUSER_PART_NUMBER: 579-MCP1811AT-028/TT; MOUSER_PRICE-STOCK: https://www.mouser.co.uk/ProductDetail/Microchip-Technology/MCP1811AT-028-TT?qs=byeeYqUIh0P62uXV3ShlCQ%3D%3D
IC3 IC6 = XC6206P122MR-G:XC6206P122MR-G: LDO Voltage Regulators 1uA Low Quiescent 3 Terminal, Low ESR Cap. Compatible, Voltage Regulator Source: Datasheet <https://www.torexsemi.com/file/xc6206/XC6206.pdf>; DESCRIPTION: LDO Voltage Regulators 1uA Low Quiescent 3 Terminal, Low ESR Cap. Compatible, Voltage Regulator; HEIGHT: 1.3mm; MANUFACTURER_NAME: Torex; MANUFACTURER_PART_NUMBER: XC6206P122MR-G; MOUSER_PART_NUMBER: 865-XC6206P122MR-G; MOUSER_PRICE-STOCK: https://www.mouser.co.uk/ProductDetail/Torex-Semiconductor/XC6206P122MR-G?qs=AsjdqWjXhJ%2F35%2FU%2FZk2JYg%3D%3D
IC8 = ADP1706ACPZ-3.3-R7:ADP1706ACPZ-3.3-R7: ANALOG DEVICES - ADP1706ACPZ-3.3-R7 - LDO, FIXED, 3.3V, 1A, LFCSP-8 Source: Datasheet <https://componentsearchengine.com/Datasheets/1/ADP1706ACPZ-3.3-R7.pdf>; DESCRIPTION: ANALOG DEVICES - ADP1706ACPZ-3.3-R7 - LDO, FIXED, 3.3V, 1A, LFCSP-8; HEIGHT: 0.8mm; MANUFACTURER_NAME: Analog Devices; MANUFACTURER_PART_NUMBER: ADP1706ACPZ-3.3-R7; MOUSER_PART_NUMBER: 584-ADP1706ACPZ3.3R7; MOUSER_PRICE-STOCK: https://www.mouser.com/Search/Refine.aspx?Keyword=584-ADP1706ACPZ3.3R7
J1 J2 = 505278-2433-main:505278-2433: FFC & FPC Connectors 0.5 FFC ZIF BTM CONT 24Ckt R/A FRONT FLIP Source: Datasheet <https://www.molex.com/pdm_docs/sd/5052782433_sd.pdf>; DESCRIPTION: FFC & FPC Connectors 0.5 FFC ZIF BTM CONT 24Ckt R/A FRONT FLIP; HEIGHT: 2.15mm; MANUFACTURER_NAME: Molex; MANUFACTURER_PART_NUMBER: 505278-2433; MOUSER_PART_NUMBER: 538-505278-2433; MOUSER_PRICE-STOCK: https://www.mouser.co.uk/ProductDetail/Molex/505278-2433?qs=c8NFF48pVsA%2FR7fI7C8RJQ%3D%3D
J3 = AXT350124:AXT350124: Board to Board & Mezzanine Connectors Socket 0.4mm pitch 50-PIN, NI-BARRIER Source: Datasheet <https://www.arrow.com/en/products/axt350124/panasonic>; DESCRIPTION: Board to Board & Mezzanine Connectors Socket 0.4mm pitch 50-PIN, NI-BARRIER; HEIGHT: 1.45mm; MANUFACTURER_NAME: Panasonic; MANUFACTURER_PART_NUMBER: AXT350124; MOUSER_PART_NUMBER: 769-AXT350124; MOUSER_PRICE-STOCK: https://www.mouser.co.uk/ProductDetail/Panasonic-Industrial-Devices/AXT350124?qs=3aug5cyrIbeP4I891VOOqg%3D%3D
J4 = 505278-2433-main:505278-2433: FFC & FPC Connectors 0.5 FFC ZIF BTM CONT 24Ckt R/A FRONT FLIP Source: Datasheet <https://www.molex.com/pdm_docs/sd/5052782433_sd.pdf>; DESCRIPTION: FFC & FPC Connectors 0.5 FFC ZIF BTM CONT 24Ckt R/A FRONT FLIP; HEIGHT: 2.15mm; MANUFACTURER_NAME: Molex; MANUFACTURER_PART_NUMBER: 505278-2433; MOUSER_PART_NUMBER: 538-505278-2433; MOUSER_PRICE-STOCK: https://www.mouser.co.uk/ProductDetail/Molex/505278-2433?qs=c8NFF48pVsA%2FR7fI7C8RJQ%3D%3D; SPICEPREFIX: X
Q1 = BSS138P_215:BSS138P,215: BSS138P,215 N-Channel MOSFET, 360 mA, 60 V, 3-Pin SOT-23 Nexperia Source: Datasheet; DESCRIPTION: BSS138P,215 N-Channel MOSFET, 360 mA, 60 V, 3-Pin SOT-23 Nexperia; HEIGHT: 1.1mm; MANUFACTURER_NAME: Nexperia; MANUFACTURER_PART_NUMBER: BSS138P,215; MOUSER_PART_NUMBER: 771-BSS138P215; MOUSER_PRICE-STOCK: https://www.mouser.co.uk/ProductDetail/Nexperia/BSS138P215?qs=A1cBxND5mHJyVAOcRahidg%3D%3D
R1-R21 = Resistor:R: Resistor Fixed - Generic; CATEGORY: Resistor; SUB-CATEGORY: Fixed
U$2 U$4 U$6 = APS1604M-3SQR-SN:APS1604M-3SQR-ZR
U$3 = W25Q128JVEIQ TR:W25Q128JVEIQ
U$5 = 503480-1800:503480-1800: Molex 503480 Series 0.5mm Pitch 18 Way SMT Female FPC Connector Source: Datasheet <https://www.molex.com/pdm_docs/sd/5034801800_sd.pdf>; DESCRIPTION: Molex 503480 Series 0.5mm Pitch 18 Way SMT Female FPC Connector; HEIGHT: 1.87mm; MANUFACTURER_NAME: Molex; MANUFACTURER_PART_NUMBER: 503480-1800; MOUSER_PART_NUMBER: 538-503480-1800; MOUSER_PRICE-STOCK: https://www.mouser.co.uk/ProductDetail/Molex/503480-1800?qs=6kT3pPPHxnV1JeObKwf9bQ%3D%3D
Y1-Y3 = ABM11W-40.0000MHZ-8-B1U-T3:ABM11W-40.0000MHZ-8-B1U-T3: Crystals 40MHz 8pF -20C +70C 10ppm Source: Datasheet <https://ms.componentsearchengine.com/Datasheets/1/ABM11W-40.0000MHZ-8-B1U-T3.pdf>; DESCRIPTION: Crystals 40MHz 8pF -20C +70C 10ppm; HEIGHT: 0.5mm; MANUFACTURER_NAME: ABRACON; MANUFACTURER_PART_NUMBER: ABM11W-40.0000MHZ-8-B1U-T3; MOUSER_PART_NUMBER: 815-11W40-8B1UT; MOUSER_PRICE-STOCK: https://www.mouser.co.uk/ProductDetail/ABRACON/ABM11W-400000MHZ-8-B1U-T3?qs=5aG0NVq1C4zBPqtAp7cErw%3D%3D